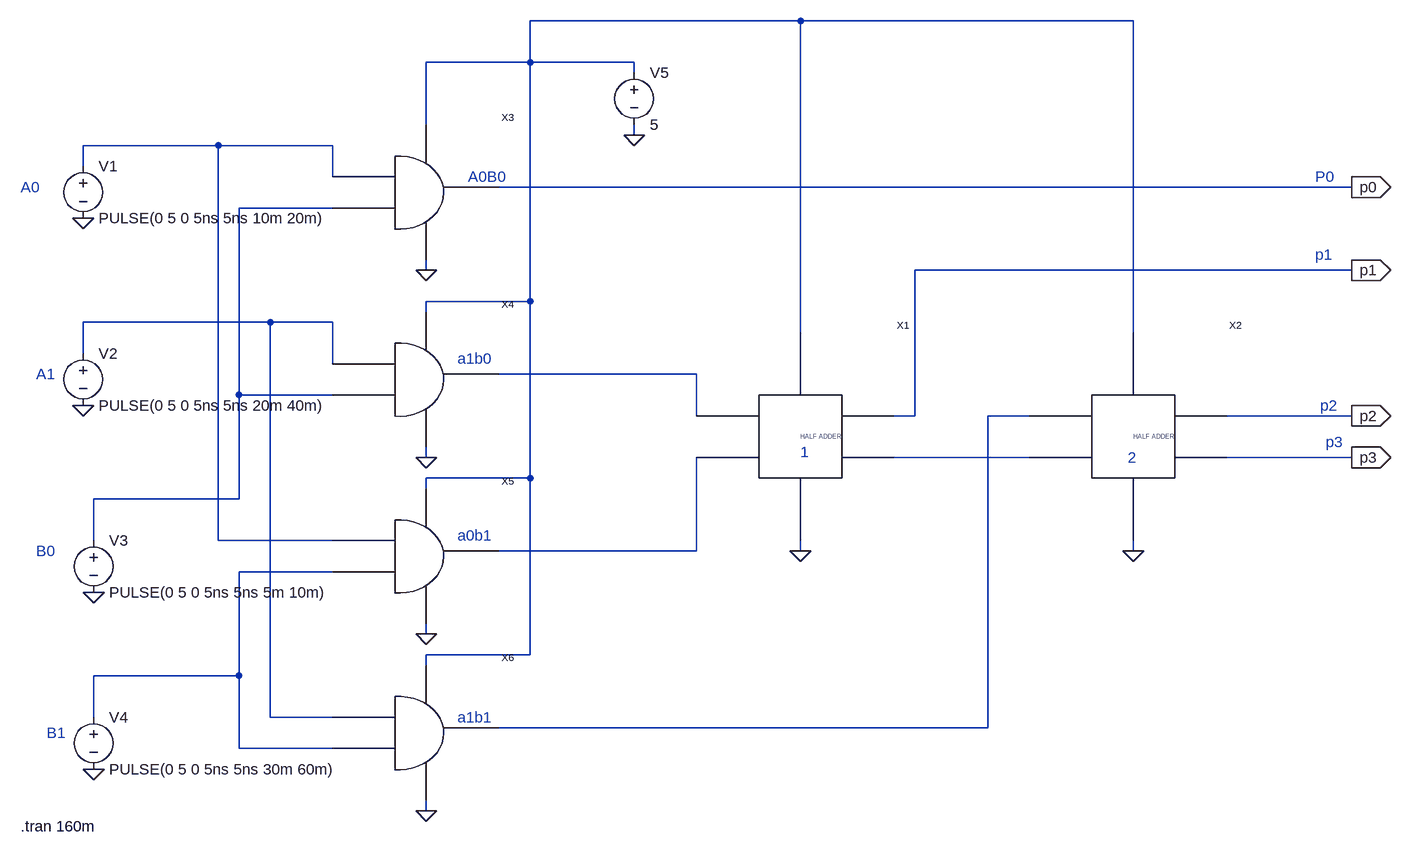
[diagram p0: schematic 2bitmultipliertesting.asc]
2bitmultipliertesting.asc, the LTspice schematic file:
Version 4
SHEET 1 1272 680
WIRE 336 -640 -80 -640
WIRE 848 -640 336 -640
WIRE -80 -576 -80 -640
WIRE -80 -576 -240 -576
WIRE 80 -576 -80 -576
WIRE 80 -560 80 -576
WIRE -240 -480 -240 -576
WIRE 80 -464 80 -480
WIRE -560 -448 -768 -448
WIRE -384 -448 -560 -448
WIRE -768 -416 -768 -448
WIRE -384 -400 -384 -448
WIRE 1184 -384 -128 -384
WIRE -384 -352 -528 -352
WIRE -240 -256 -240 -272
WIRE 1184 -256 512 -256
WIRE -80 -208 -80 -576
WIRE -80 -208 -240 -208
WIRE -240 -192 -240 -208
WIRE -480 -176 -768 -176
WIRE -384 -176 -480 -176
WIRE 336 -160 336 -640
WIRE 848 -160 848 -640
WIRE -768 -128 -768 -176
WIRE -384 -112 -384 -176
WIRE 176 -96 -128 -96
WIRE -528 -64 -528 -352
WIRE -384 -64 -528 -64
WIRE 176 -32 176 -96
WIRE 512 -32 512 -256
WIRE 512 -32 480 -32
WIRE 688 -32 624 -32
WIRE 1184 -32 992 -32
WIRE -240 32 -240 16
WIRE 688 32 480 32
WIRE 1184 32 992 32
WIRE -80 64 -80 -208
WIRE -80 64 -240 64
WIRE -240 80 -240 64
WIRE -528 96 -528 -64
WIRE -528 96 -752 96
WIRE -752 160 -752 96
WIRE -560 160 -560 -448
WIRE -384 160 -560 160
WIRE 176 176 176 32
WIRE 176 176 -128 176
WIRE 336 176 336 160
WIRE 848 176 848 160
WIRE -384 208 -528 208
WIRE -240 304 -240 288
WIRE -80 336 -80 64
WIRE -80 336 -240 336
WIRE -240 352 -240 336
WIRE -528 368 -528 208
WIRE -528 368 -752 368
WIRE -752 432 -752 368
WIRE -480 432 -480 -176
WIRE -384 432 -480 432
WIRE 624 448 624 -32
WIRE 624 448 -128 448
WIRE -528 480 -528 368
WIRE -384 480 -528 480
WIRE -240 576 -240 560
FLAG -240 -256 0
FLAG -240 32 0
FLAG -240 304 0
FLAG -240 576 0
FLAG 80 -464 0
FLAG 336 176 0
FLAG 848 176 0
FLAG -768 -336 0
FLAG -768 -48 0
FLAG -752 240 0
FLAG -752 512 0
FLAG 1184 -384 p0
IOPIN 1184 -384 Out
FLAG 1184 -256 p1
IOPIN 1184 -256 Out
FLAG 1184 -32 p2
IOPIN 1184 -32 Out
FLAG 1184 32 p3
IOPIN 1184 32 Out
SYMBOL halfadderimply 320 0 R0
SYMATTR InstName X1
SYMBOL halfadderimply 832 0 R0
SYMATTR InstName X2
SYMBOL andgateimply -352 -384 R0
SYMATTR InstName X3
SYMBOL andgateimply -352 -96 R0
SYMATTR InstName X4
SYMBOL andgateimply -352 176 R0
SYMATTR InstName X5
SYMBOL andgateimply -352 448 R0
SYMATTR InstName X6
SYMBOL voltage -768 -432 R0
WINDOW 123 0 0 Left 0
WINDOW 39 0 0 Left 0
SYMATTR InstName V1
SYMATTR Value PULSE(0 5 0 5ns 5ns 10m 20m)
SYMBOL voltage -768 -144 R0
WINDOW 123 0 0 Left 0
WINDOW 39 0 0 Left 0
SYMATTR InstName V2
SYMATTR Value PULSE(0 5 0 5ns 5ns 20m 40m)
SYMBOL voltage -752 144 R0
WINDOW 123 0 0 Left 0
WINDOW 39 0 0 Left 0
SYMATTR InstName V3
SYMATTR Value PULSE(0 5 0 5ns 5ns 5m 10m)
SYMBOL voltage -752 416 R0
WINDOW 123 0 0 Left 0
WINDOW 39 0 0 Left 0
SYMATTR InstName V4
SYMATTR Value PULSE(0 5 0 5ns 5ns 30m 60m)
SYMBOL voltage 80 -576 R0
WINDOW 123 0 0 Left 0
WINDOW 39 0 0 Left 0
SYMATTR InstName V5
SYMATTR Value 5
TEXT -864 -384 Left 2 ;A0
TEXT -840 -96 Left 2 ;A1
TEXT -840 176 Left 2 ;B0
TEXT -824 456 Left 2 ;B1
TEXT 336 24 Left 2 ;1
TEXT 840 32 Left 2 ;2
TEXT 1128 -400 Left 2 ;P0
TEXT -176 -400 Left 2 ;A0B0
TEXT -192 -120 Left 2 ;a1b0
TEXT -192 152 Left 2 ;a0b1
TEXT -192 432 Left 2 ;a1b1
TEXT 1128 -280 Left 2 ;p1
TEXT 1136 -48 Left 2 ;p2
TEXT 1144 8 Left 2 ;p3
TEXT -864 600 Left 2 !.tran 160m

The netlist it stands for:
* 2bitmultipliertesting.asc
XX1 N005 N008 N001 0 p1 N007 halfadderimply  ; pins A B VDD VSS SUM COUT
XX2 N006 N007 N001 0 p2 p3 halfadderimply  ; pins A B VDD VSS SUM COUT
XX3 N001 0 N002 N003 p0 andgateimply  ; pins VDD VSS A B OUT
XX4 N001 0 N004 N003 N005 andgateimply  ; pins VDD VSS A B OUT
XX5 N001 0 N002 N009 N008 andgateimply  ; pins VDD VSS A B OUT
XX6 N001 0 N004 N009 N006 andgateimply  ; pins VDD VSS A B OUT
V1 N002 0 PULSE(0 5 0 5ns 5ns 10m 20m)
V2 N004 0 PULSE(0 5 0 5ns 5ns 20m 40m)
V3 N003 0 PULSE(0 5 0 5ns 5ns 5m 10m)
V4 N009 0 PULSE(0 5 0 5ns 5ns 30m 60m)
V5 N001 0 5
* A0
* A1
* B0
* B1
* 1
* 2
* P0
* A0B0
* a1b0
* a0b1
* a1b1
* p1
* p2
* p3
.tran 160m
.backanno
.end